# Altium schematic sheet XORXNOR.SchDoc
size 381 x 241 mm; SheetNumber: 3; SheetTotal: 7
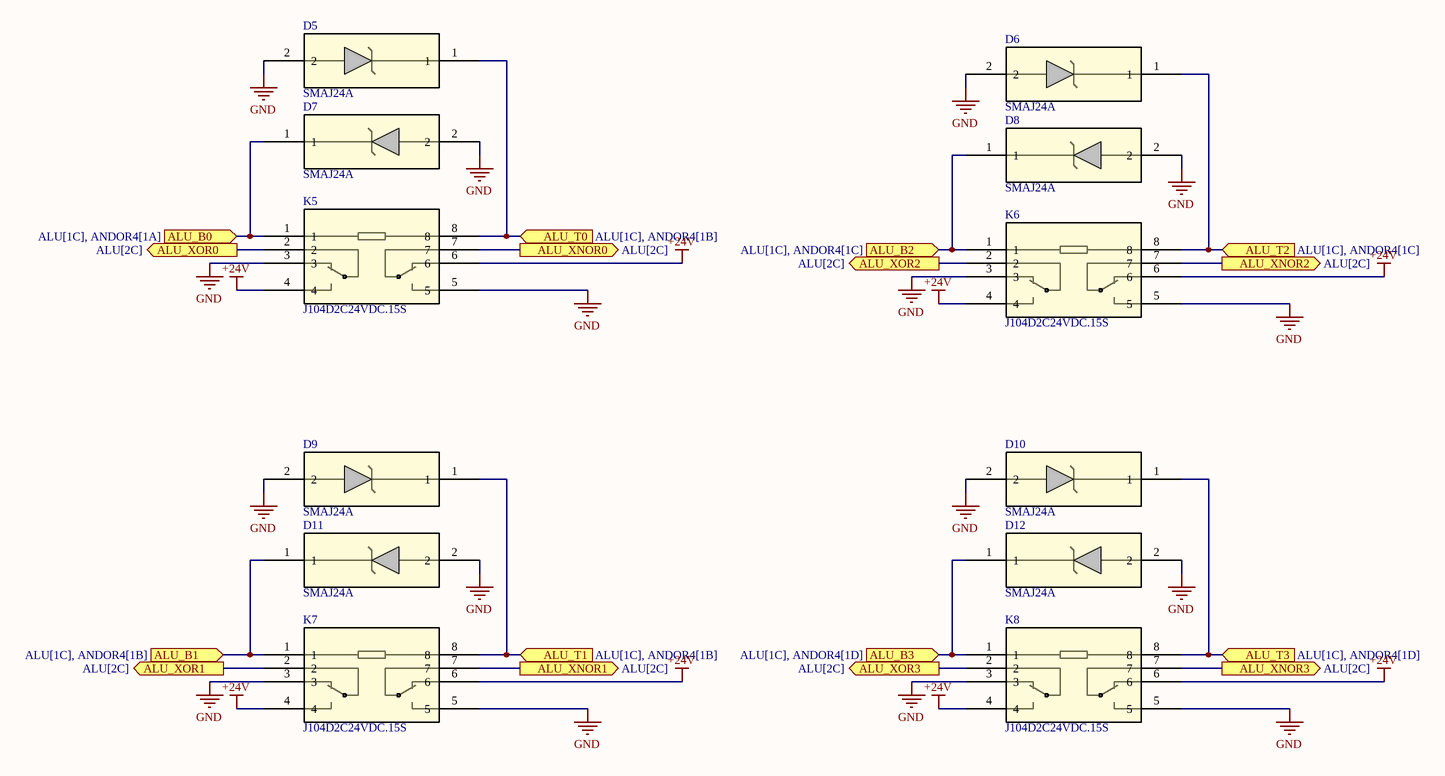
[diagram p0: XORXNOR.SchDoc]

## Parts
D5  SMAJ24A  [DI SMAJ24A]
D6  SMAJ24A  [DI SMAJ24A]
D7  SMAJ24A  [DI SMAJ24A]
D8  SMAJ24A  [DI SMAJ24A]
D9  SMAJ24A  [DI SMAJ24A]
D10  SMAJ24A  [DI SMAJ24A]
D11  SMAJ24A  [DI SMAJ24A]
D12  SMAJ24A  [DI SMAJ24A]
K5  J104D2C24VDC.15S  [Relay J104D2C24VDC.15S]
K6  J104D2C24VDC.15S  [Relay J104D2C24VDC.15S]
K7  J104D2C24VDC.15S  [Relay J104D2C24VDC.15S]
K8  J104D2C24VDC.15S  [Relay J104D2C24VDC.15S]

## Ports
ALU_B0 (in, see ALU[1C], ANDOR4[1A]), ALU_B1 (in, see ALU[1C], ANDOR4[1B]), ALU_B2 (in, see ALU[1C], ANDOR4[1C]), ALU_B3 (in, see ALU[1C], ANDOR4[1D]), ALU_T0 (in, see ALU[1C], ANDOR4[1B]), ALU_T1 (in, see ALU[1C], ANDOR4[1B]), ALU_T2 (in, see ALU[1C], ANDOR4[1C]), ALU_T3 (in, see ALU[1C], ANDOR4[1D]), ALU_XNOR0 (out, see ALU[2C]), ALU_XNOR1 (out, see ALU[2C]), ALU_XNOR2 (out, see ALU[2C]), ALU_XNOR3 (out, see ALU[2C]), ALU_XOR0 (out, see ALU[2C]), ALU_XOR1 (out, see ALU[2C]), ALU_XOR2 (out, see ALU[2C]), ALU_XOR3 (out, see ALU[2C])

## Nets
+24V: K5.4 K5.6 K6.4 K6.6 K7.4 K7.6 K8.4 K8.6
GND: D5.2 D6.2 D7.2 D8.2 D9.2 D10.2 D11.2 D12.2 K5.3 K5.5 K6.3 K6.5 K7.3 K7.5 K8.3 K8.5
ALU_B0: D7.1 K5.1 ; port ALU_B0
ALU_B1: D11.1 K7.1 ; port ALU_B1
ALU_B2: D8.1 K6.1 ; port ALU_B2
ALU_B3: D12.1 K8.1 ; port ALU_B3
ALU_T0: D5.1 K5.8 ; port ALU_T0
ALU_T1: D9.1 K7.8 ; port ALU_T1
ALU_T2: D6.1 K6.8 ; port ALU_T2
ALU_T3: D10.1 K8.8 ; port ALU_T3
ALU_XNOR0: K5.7 ; port ALU_XNOR0
ALU_XNOR1: K7.7 ; port ALU_XNOR1
ALU_XNOR2: K6.7 ; port ALU_XNOR2
ALU_XNOR3: K8.7 ; port ALU_XNOR3
ALU_XOR0: K5.2 ; port ALU_XOR0
ALU_XOR1: K7.2 ; port ALU_XOR1
ALU_XOR2: K6.2 ; port ALU_XOR2
ALU_XOR3: K8.2 ; port ALU_XOR3

## Library data of the parts
D5-D12 = DI SMAJ24A: SMAJ Series 400 W 24 V Uni-Directional Surface Mount TVS Diode - DO-214AC; Manufacturer: Littelfuse; Breakdown Voltage: 28.1V; Value: 650pF; Clamping Voltage: 38.9V; Direction: Unidirectional; Element Configuration: Single; Forward Voltage: 3.5V; Leakage Current: 1µA; Max Breakdown Voltage: 29.5V; Max Junction Temperature (Tj): 150°C; Max Output current: 10.3A; Max Power Dissipation: 3.3W; Min Breakdown Voltage: 26.7V; Number of Channels: 1; Operating Supply Voltage: 24V; Peak Pulse Power: 400W; Power Line Protection: No; Test Current: 1mA; Supplier: DigiKey; Supplier Part Number: SMAJ24ALFCT-ND; Manufacturer Part Number: SMAJ24A; RoHS: Compliant; Category: TVS Diodes; Stock: 97583; Pricing: 1=0.21, 10=0.113, 100=0.074, 500=0.072, 1000=0.071 (USD); Case/Package: SMA; China RoHS: Non-Compliant; Composition: Zener; Height: 2.29mm; Lead Free: Lead Free; Length: 4.5mm; Lifecycle Status: Production; Max Operating Temperature: 150°C; Max Reverse Leakage Current: 1µA; Max Surge Current: 10.3A; Min Operating Temperature: -65°C; Mounting Technology: Surface Mount; Number of Elements: 1; Pins: 2; Number of Terminals: 2; Number of Unidirectional Channels: 1; Packaging: Tape & Reel; Peak Pulse Current: 10.3A; Peak Reverse Current: 1µA; Polarity: Unidirectional; Power Dissipation: 400W; Power Rating: 400W; Radiation Hardening: No; REACH SVHC: No; Reverse Breakdown Voltage: 26.7V; Reverse Standoff Voltage: 24V; Reverse Voltage: 24V; Schedule B: 8541100080, 8541100080|8541100080|8541100080|8541100080|8541100080; Termination: SMD/SMT; Voltage Rating (DC): 24V; Width: 2.79mm; ComponentLink1URL: https://datasheet.octopart.com:443/SMAJ24A-Littelfuse-datasheet-150463581.pdf?src-supplier=Farnell; ComponentLink1Description: https://datasheet.octopart.com:443/SMAJ24A-Littelfuse-datasheet-150463581.pdf?src-supplier=Farnell; ComponentLink2URL: https://datasheet.octopart.com:443/SMAJ24A-Littelfuse-datasheet-63710798.pdf?src-supplier=element14+APAC; ComponentLink2Description: https://datasheet.octopart.com:443/SMAJ24A-Littelfuse-datasheet-63710798.pdf?src-supplier=element14+APAC; ComponentLink3URL: https://datasheet.octopart.com:443/SMAJ24A-Littelfuse-datasheet-11547152.pdf?src-supplier=element14+APAC; ComponentLink3Description: https://datasheet.octopart.com:443/SMAJ24A-Littelfuse-datasheet-11547152.pdf?src-supplier=element14+APAC; ComponentLink4URL: https://datasheet.octopart.com:443/SMAJ24A-Littelfuse-datasheet-5393952.pdf?src-supplier=element14+APAC; ComponentLink4Description: https://datasheet.octopart.com:443/SMAJ24A-Littelfuse-datasheet-5393952.pdf?src-supplier=element14+APAC; ComponentLink5URL: https://datasheet.octopart.com:443/SMAJ24A-Littelfuse-datasheet-511791.pdf?src-supplier=element14+APAC; ComponentLink5Description: https://datasheet.octopart.com:443/SMAJ24A-Littelfuse-datasheet-511791.pdf?src-supplier=element14+APAC; ComponentLink6URL: https://datasheet.octopart.com:443/SMAJ24A-Littelfuse-datasheet-164649624.pdf?src-supplier=JRH+Electronics; ComponentLink6Description: https://datasheet.octopart.com:443/SMAJ24A-Littelfuse-datasheet-164649624.pdf?src-supplier=JRH+Electronics; ComponentLink7URL: https://datasheet.octopart.com:443/SMAJ24A-Littelfuse-datasheet-38878911.pdf?src-supplier=RS+(Formerly+Allied+Electronics); ComponentLink7Description: https://datasheet.octopart.com:443/SMAJ24A-Littelfuse-datasheet-38878911.pdf?src-supplier=RS+(Formerly+Allied+Electronics); ComponentLink8URL: https://datasheet.octopart.com:443/SMAJ24A-Littelfuse-datasheet-17901671.pdf?src-supplier=Future+Electronics; ComponentLink8Description: https://datasheet.octopart.com:443/SMAJ24A-Littelfuse-datasheet-17901671.pdf?src-supplier=Future+Electronics; ComponentLink9URL: https://datasheet.octopart.com:443/SMAJ24A-Littelfuse-datasheet-1053.pdf?src-supplier=DigiKey; ComponentLink9Description: https://datasheet.octopart.com:443/SMAJ24A-Littelfuse-datasheet-1053.pdf?src-supplier=DigiKey
K5-K8 = Relay J104D2C24VDC.15S: Relay Ul Gen Purp DPDT 2C 24VDC; Manufacturer: CIT Relay & Switch; Coil Current: 6mA; Coil Power: 150mW; Coil Resistance: 3.84kΩ; Coil Voltage (DC): 18V; Contact Current Rating: 2A; Contact Resistance: 50mΩ; Contact Voltage Rating (AC): 250V; Electrical Life: 100kcycles; Insulation Resistance: 100MΩ; Max Voltage Rating (DC): 100V; Release Time: 4ms; Response Time: 6ms; Supplier: DigiKey; Supplier Part Number: 2449-J104D2C24VDC.15S-ND; Manufacturer Part Number: J104D2C24VDC.15S; Category: Signal Relays; Stock: 5620; Pricing: 1=1.26, 20=1.082, 40=1.045, 60=1.02383, 100=0.998, 260=0.95115, 500=0.92036, 1000=0.88878, 5000=0.8195 (USD); Contact Plating: Gold; Height: 11.42mm; Length: 20.37mm; Max Current Rating: 2A; Max Operating Temperature: 85°C; Min Operating Temperature: -40°C; Number of Terminals: 8; Throw Configuration: DPDT